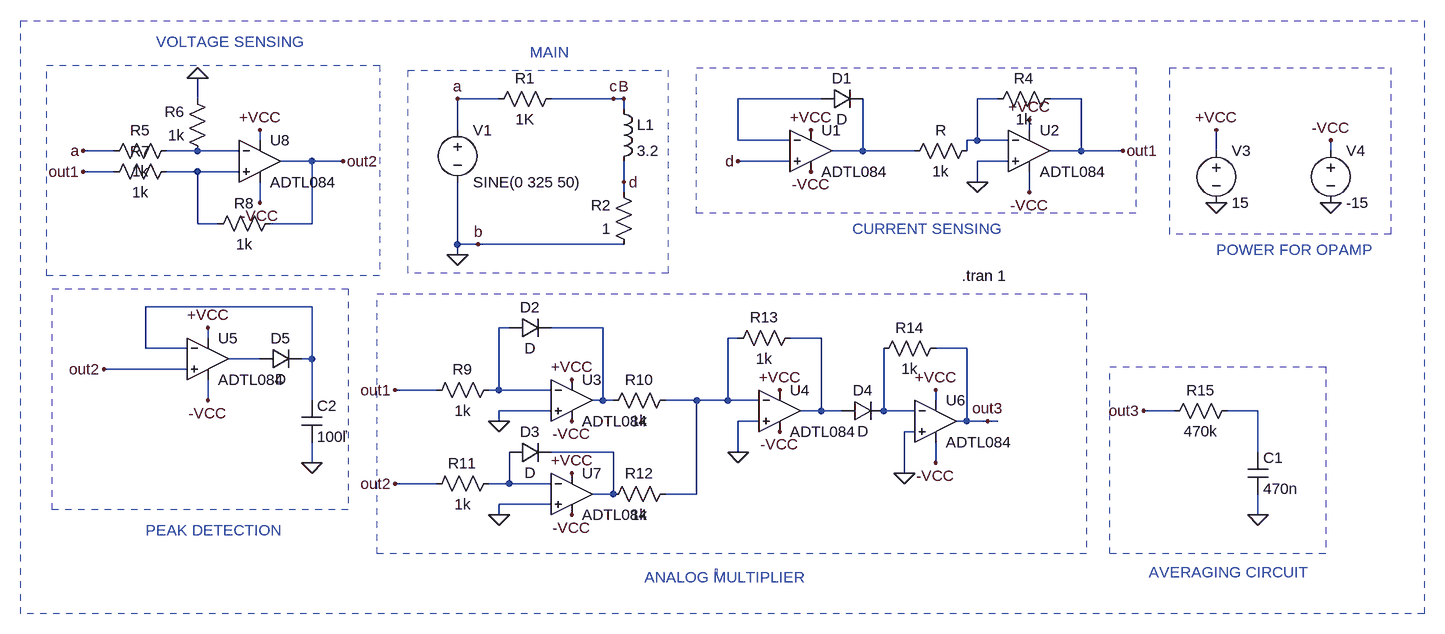
[diagram p0: schematic Postlab1_ltspicelab.asc]
Postlab1_ltspicelab.asc, the LTspice schematic file:
Version 4
SHEET 1 1984 1128
WIRE -704 -64 -704 -96
WIRE -240 -64 -304 -64
WIRE -64 -64 -160 -64
WIRE -48 -64 -64 -64
WIRE 256 -64 128 -64
WIRE 528 -64 496 -64
WIRE 656 -64 608 -64
WIRE -48 -48 -48 -64
WIRE -304 -16 -304 -64
WIRE 576 -16 576 -32
WIRE -608 0 -608 -16
WIRE 128 0 128 -64
WIRE 208 0 128 0
WIRE 496 0 496 -64
WIRE 496 0 480 0
WIRE 544 0 496 0
WIRE -832 16 -880 16
WIRE -704 16 -752 16
WIRE -640 16 -704 16
WIRE 320 16 320 -64
WIRE 320 16 272 16
WIRE 400 16 320 16
WIRE 480 16 480 0
WIRE 656 16 656 -64
WIRE 656 16 608 16
WIRE 720 16 656 16
WIRE 864 16 864 -16
WIRE 1040 16 1040 0
WIRE -528 32 -576 32
WIRE -480 32 -528 32
WIRE 208 32 128 32
WIRE 544 32 496 32
WIRE -832 48 -880 48
WIRE -704 48 -752 48
WIRE -640 48 -704 48
WIRE -48 64 -48 32
WIRE 496 64 496 32
WIRE -48 80 -48 64
WIRE 576 80 576 48
WIRE -608 96 -608 64
WIRE -704 128 -704 48
WIRE -672 128 -704 128
WIRE -528 128 -528 32
WIRE -528 128 -592 128
WIRE -304 160 -304 64
WIRE -272 160 -304 160
WIRE -48 160 -272 160
WIRE -304 176 -304 160
WIRE -528 256 -784 256
WIRE -224 288 -240 288
WIRE -80 288 -160 288
WIRE -688 304 -688 288
WIRE 128 304 112 304
WIRE 256 304 208 304
WIRE -784 320 -784 256
WIRE -720 320 -784 320
WIRE 480 320 432 320
WIRE -608 336 -656 336
WIRE -528 336 -528 256
WIRE -528 336 -544 336
WIRE -720 352 -848 352
WIRE -336 384 -400 384
WIRE -240 384 -240 288
WIRE -240 384 -256 384
WIRE -160 384 -240 384
WIRE -688 400 -688 368
WIRE -528 400 -528 336
WIRE -80 400 -80 288
WIRE -80 400 -96 400
WIRE -64 400 -80 400
WIRE 64 400 16 400
WIRE 112 400 112 304
WIRE 112 400 64 400
WIRE 160 400 112 400
WIRE 432 400 432 384
WIRE -160 416 -240 416
WIRE 256 416 256 304
WIRE 256 416 224 416
WIRE 288 416 256 416
WIRE 352 416 352 320
WIRE 400 416 352 416
WIRE 800 416 752 416
WIRE 928 416 880 416
WIRE -240 432 -240 416
WIRE 160 432 128 432
WIRE 480 432 480 320
WIRE 480 432 464 432
WIRE 512 432 480 432
WIRE 528 432 512 432
WIRE 400 448 384 448
WIRE -64 480 -160 480
WIRE 128 480 128 432
WIRE 928 480 928 416
WIRE -528 496 -528 464
WIRE 432 496 432 464
WIRE 384 512 384 448
WIRE -336 528 -400 528
WIRE -224 528 -224 480
WIRE -224 528 -256 528
WIRE -160 528 -224 528
WIRE -64 544 -64 480
WIRE -64 544 -96 544
WIRE 64 544 64 400
WIRE 64 544 16 544
WIRE -160 560 -240 560
WIRE -240 576 -240 560
WIRE 928 576 928 544
FLAG 496 64 0
FLAG -704 -96 0
FLAG -240 432 0
FLAG -240 576 0
FLAG 384 512 0
FLAG 128 480 0
FLAG 928 576 0
FLAG -528 496 0
FLAG 864 96 0
FLAG 1040 96 0
FLAG 864 -16 +VCC
FLAG 1040 0 -VCC
FLAG 576 -32 +VCC
FLAG 576 80 -VCC
FLAG -608 -16 +VCC
FLAG -608 96 -VCC
FLAG -688 288 +VCC
FLAG -688 400 -VCC
FLAG 432 384 +VCC
FLAG 432 496 -VCC
FLAG -304 -64 a
FLAG -48 -64 B
FLAG -48 64 d
FLAG 192 384 +VCC
FLAG 192 448 -VCC
FLAG -128 432 -VCC
FLAG -128 368 +VCC
FLAG -128 576 -VCC
FLAG -128 512 +VCC
FLAG 240 48 -VCC
FLAG 240 -16 +VCC
FLAG -272 160 b
FLAG -64 -64 c
FLAG -304 176 0
FLAG 128 32 d
FLAG 720 16 out1
FLAG -880 48 out1
FLAG -480 32 out2
FLAG -880 16 a
FLAG -400 384 out1
FLAG -400 528 out2
FLAG 512 432 out3
FLAG 752 416 out3
FLAG -848 352 out2
SYMBOL voltage -304 -32 R0
SYMATTR InstName V1
SYMATTR Value SINE(0 325 50)
SYMBOL res -144 -80 R90
WINDOW 0 0 56 VBottom 2
WINDOW 3 32 56 VTop 2
SYMATTR InstName R1
SYMATTR Value 1K
SYMBOL res -32 176 R180
WINDOW 0 36 76 Left 2
WINDOW 3 36 40 Left 2
SYMATTR InstName R2
SYMATTR Value 1
SYMBOL ind -64 -64 R0
SYMATTR InstName L1
SYMATTR Value 3.2
SYMBOL Diode 256 -48 R270
WINDOW 0 32 32 VTop 2
WINDOW 3 0 32 VBottom 2
SYMATTR InstName D1
SYMBOL Res 496 0 R90
WINDOW 0 0 56 VBottom 2
WINDOW 3 32 56 VTop 2
SYMATTR InstName R
SYMATTR Value 1k
SYMBOL Res 624 -80 R90
WINDOW 0 0 56 VBottom 2
WINDOW 3 32 56 VTop 2
SYMATTR InstName R4
SYMATTR Value 1k
SYMBOL Res -736 0 R90
WINDOW 0 0 56 VBottom 2
WINDOW 3 32 56 VTop 2
SYMATTR InstName R5
SYMATTR Value 1k
SYMBOL Res -688 32 R180
WINDOW 0 36 76 Left 2
WINDOW 3 36 40 Left 2
SYMATTR InstName R6
SYMATTR Value 1k
SYMBOL Res -848 64 R270
WINDOW 0 32 56 VTop 2
WINDOW 3 0 56 VBottom 2
SYMATTR InstName R7
SYMATTR Value 1k
SYMBOL Res -688 144 R270
WINDOW 0 32 56 VTop 2
WINDOW 3 0 56 VBottom 2
SYMATTR InstName R8
SYMATTR Value 1k
SYMBOL Res -240 368 R90
WINDOW 0 0 56 VBottom 2
WINDOW 3 32 56 VTop 2
SYMATTR InstName R9
SYMATTR Value 1k
SYMBOL Diode -224 304 R270
WINDOW 0 32 32 VTop 2
WINDOW 3 0 32 VBottom 2
SYMATTR InstName D2
SYMBOL Diode -224 496 R270
WINDOW 0 32 32 VTop 2
WINDOW 3 0 32 VBottom 2
SYMATTR InstName D3
SYMBOL Res 32 384 R90
WINDOW 0 0 56 VBottom 2
WINDOW 3 32 56 VTop 2
SYMATTR InstName R10
SYMATTR Value 1k
SYMBOL Res -240 512 R90
WINDOW 0 0 56 VBottom 2
WINDOW 3 32 56 VTop 2
SYMATTR InstName R11
SYMATTR Value 1k
SYMBOL Res 32 528 R90
WINDOW 0 0 56 VBottom 2
WINDOW 3 32 56 VTop 2
SYMATTR InstName R12
SYMATTR Value 1k
SYMBOL Res 224 288 R90
WINDOW 0 0 56 VBottom 2
WINDOW 3 32 56 VTop 2
SYMATTR InstName R13
SYMATTR Value 1k
SYMBOL Diode 288 432 R270
WINDOW 0 32 32 VTop 2
WINDOW 3 0 32 VBottom 2
SYMATTR InstName D4
SYMBOL Res 448 304 R90
WINDOW 0 0 56 VBottom 2
WINDOW 3 32 56 VTop 2
SYMATTR InstName R14
SYMATTR Value 1k
SYMBOL Res 896 400 R90
WINDOW 0 0 56 VBottom 2
WINDOW 3 32 56 VTop 2
SYMATTR InstName R15
SYMATTR Value 470k
SYMBOL Cap 912 480 R0
SYMATTR InstName C1
SYMATTR Value 470n
SYMBOL Diode -608 352 R270
WINDOW 0 32 32 VTop 2
WINDOW 3 0 32 VBottom 2
SYMATTR InstName D5
SYMBOL Cap -544 400 R0
SYMATTR InstName C2
SYMATTR Value 100ľ
SYMBOL Voltage 864 0 R0
SYMATTR InstName V3
SYMATTR Value 15
SYMBOL Voltage 1040 0 R0
SYMATTR InstName V4
SYMATTR Value -15
SYMBOL OpAmps/ADTL084 240 -48 R0
SYMATTR InstName U1
SYMBOL OpAmps/ADTL084 576 -48 R0
SYMATTR InstName U2
SYMBOL OpAmps/ADTL084 -128 336 R0
SYMATTR InstName U3
SYMBOL OpAmps/ADTL084 192 352 R0
SYMATTR InstName U4
SYMBOL OpAmps/ADTL084 -688 272 R0
SYMATTR InstName U5
SYMBOL OpAmps/ADTL084 432 368 R0
SYMATTR InstName U6
SYMBOL OpAmps/ADTL084 -128 480 R0
SYMATTR InstName U7
SYMBOL OpAmps/ADTL084 -608 -32 R0
SYMATTR InstName U8
TEXT 472 208 Left 2 !.tran 1
TEXT -768 -152 Left 2 ;VOLTAGE SENSING
TEXT 304 136 Left 2 ;CURRENT SENSING
TEXT -192 -136 Left 2 ;MAIN
TEXT -16 672 Left 2 ;ANALOG MULTIPLIER
TEXT 760 664 Left 2 ;AVERAGING CIRCUIT
TEXT -784 600 Left 2 ;PEAK DETECTION
TEXT 864 168 Left 2 ;POWER FOR OPAMP
RECTANGLE Normal 700 348 1032 636 2
RECTANGLE Normal -380 -108 20 204 2
RECTANGLE Normal 64 -112 740 112 2
RECTANGLE Normal -936 -116 -424 208 2
RECTANGLE Normal -928 228 -472 568 2
RECTANGLE Normal 92 668 96 660 2
RECTANGLE Normal -428 236 664 636 2
RECTANGLE Normal 792 -112 1132 144 2
RECTANGLE Normal -976 -184 1184 728 2

The netlist it stands for:
* Postlab1_ltspicelab.asc
V1 a 0 SINE(0 325 50)
R1 0 a 1K
R2 0 d 1
L1 0 d 3.2
D1 N001 N004 D
R N002 N004 1k
R4 out1 N002 1k
R5 N003 a 1k
R6 N003 0 1k
R7 out1 N005 1k
R8 N005 out2 1k
R9 N007 out1 1k
D2 N007 N008 D
D3 N015 N014 D
R10 N009 N008 1k
R11 N015 out2 1k
R12 N009 N014 1k
R13 N010 N009 1k
D4 N010 N012 D
R14 out3 N012 1k
R15 N013 out3 470k
C1 N013 0 470n
D5 N011 N006 D
C2 N006 0 100ľ
V3 +VCC 0 15
V4 -VCC 0 -15
XU1 d N001 +VCC -VCC N004 ADTL084  ; pins In+ In- V+ V- OUT
XU2 0 N002 +VCC -VCC out1 ADTL084  ; pins In+ In- V+ V- OUT
XU3 0 N007 +VCC -VCC N008 ADTL084  ; pins In+ In- V+ V- OUT
XU4 0 N009 +VCC -VCC N010 ADTL084  ; pins In+ In- V+ V- OUT
XU5 out2 N006 +VCC -VCC N011 ADTL084  ; pins In+ In- V+ V- OUT
XU6 0 N012 +VCC -VCC out3 ADTL084  ; pins In+ In- V+ V- OUT
XU7 0 N015 +VCC -VCC N014 ADTL084  ; pins In+ In- V+ V- OUT
XU8 N005 N003 +VCC -VCC out2 ADTL084  ; pins In+ In- V+ V- OUT
.model D D
.lib standard.dio
.tran 1
* VOLTAGE SENSING
* CURRENT SENSING
* MAIN
* ANALOG MULTIPLIER
* AVERAGING CIRCUIT
* PEAK DETECTION
* POWER FOR OPAMP
.lib ADTL084.lib
.backanno
.end